# EAGLE design Actor_6_Channel (EAGLE 6.1)
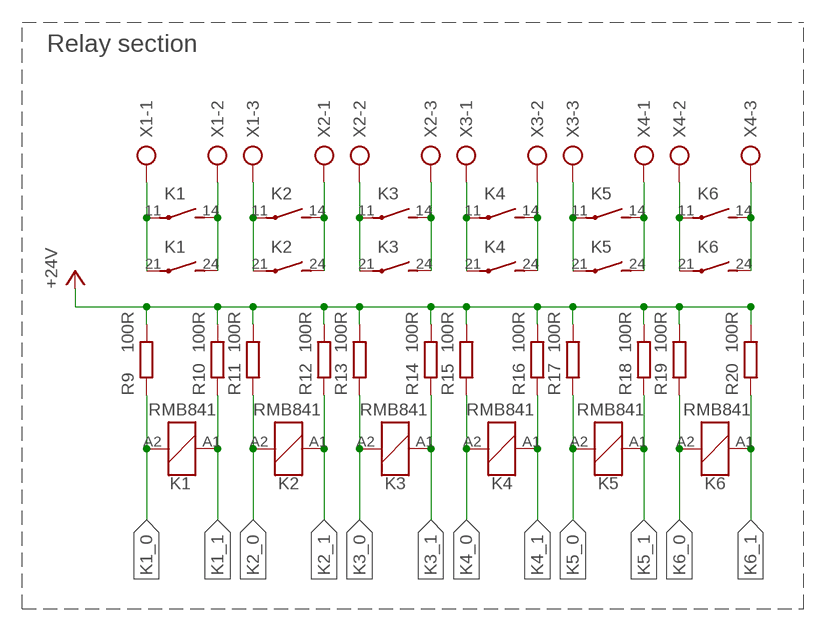
[diagram p0: schematic, sheet 1, part 1 of 2]
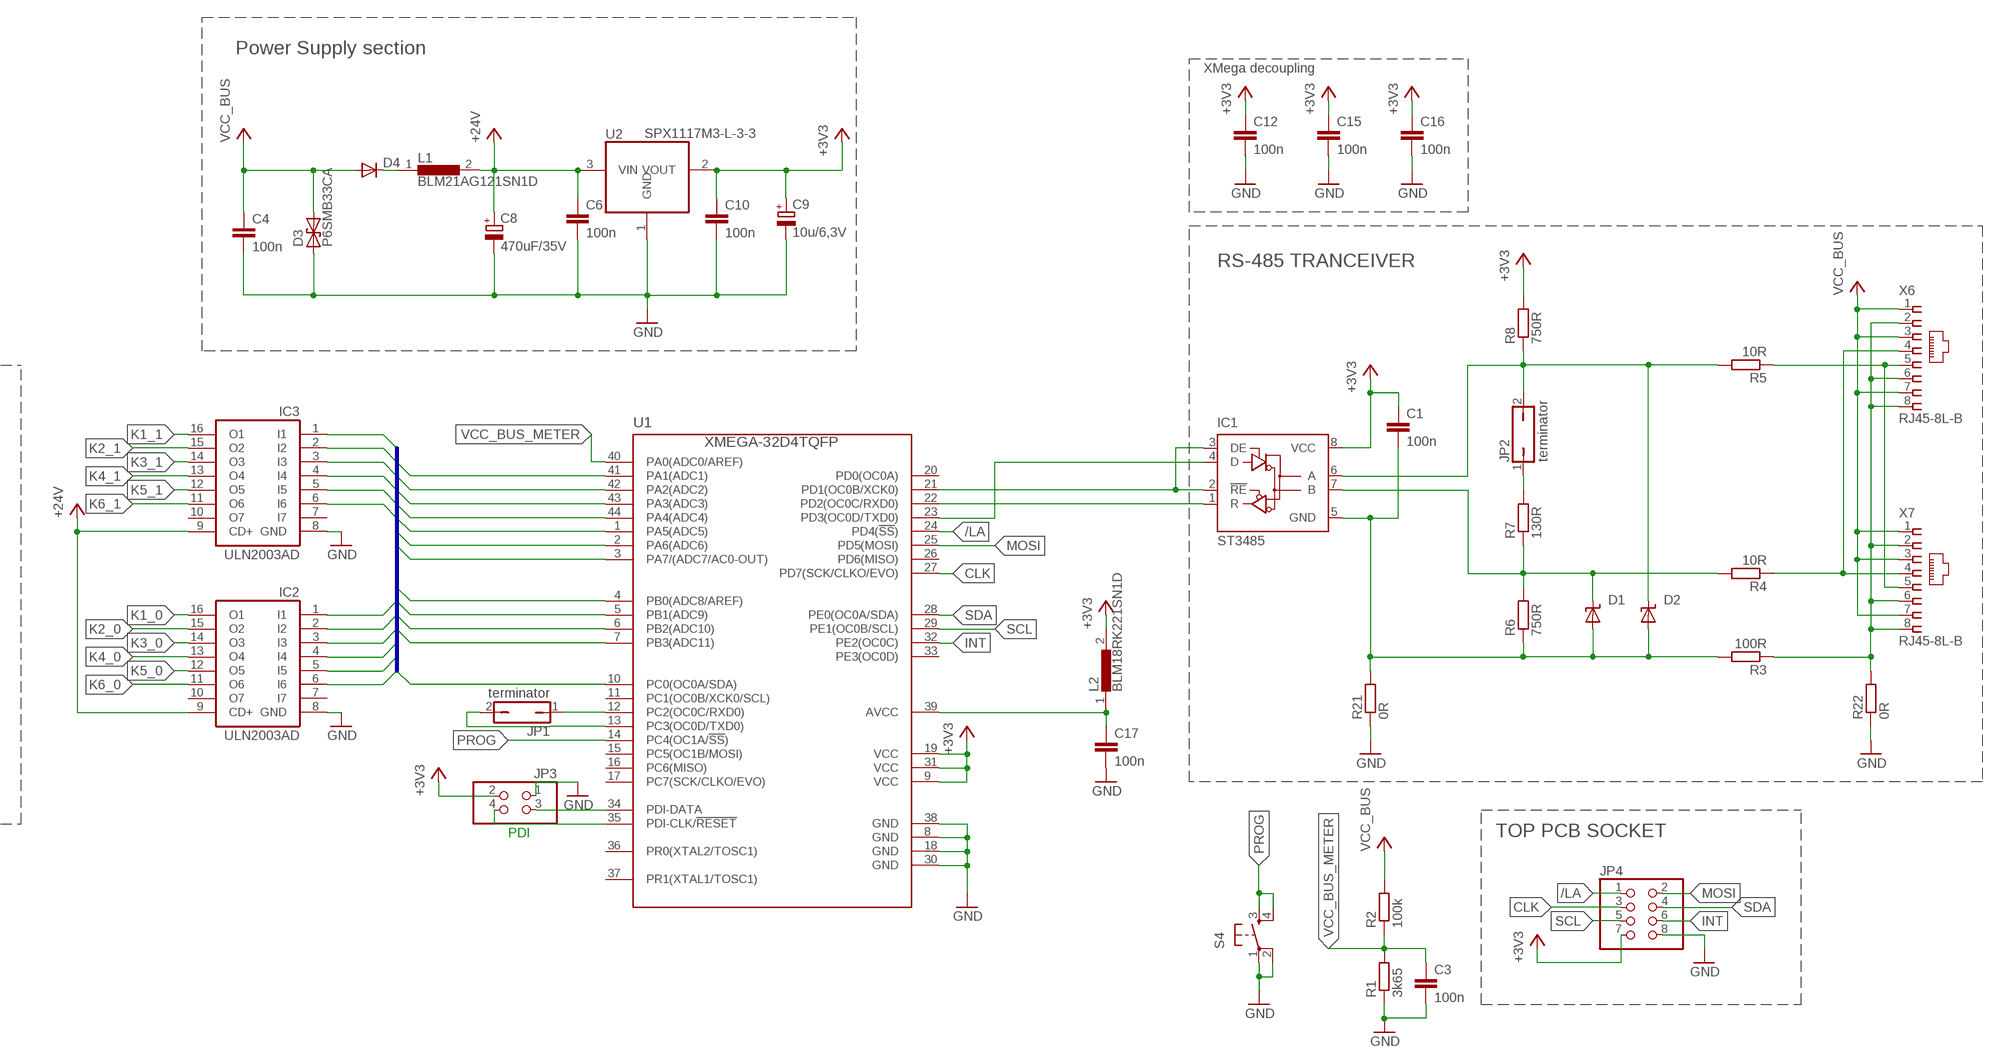
[diagram p1: schematic, sheet 1, part 2 of 2]

## Parts
C1  100n  C-EUC0603K  [C0603K]
C3  100n  C-EUC0603K  [C0603K]
C4  100n  C-EUC0603K  [C0603K]
C6  100n  C-EUC0603K  [C0603K]
C8  470uF/35V  CPOL-EUE5-10.5  [E5-10,5]
C9  10u/6,3V  CPOL-EUE2-4  [E2-4]
C10  100n  C-EUC0603K  [C0603K]
C12  100n  C-EUC0603K  [C0603K]
C15  100n  C-EUC0603K  [C0603K]
C16  100n  C-EUC0603K  [C0603K]
C17  100n  C-EUC0603K  [C0603K]
D1  SUPPRESSOR-SMBJ  [SMBJ]
D2  SUPPRESSOR-SMBJ  [SMBJ]
D3  P6SMB33CA  P6KEXXCSMD  [DO214AA]
D4  DIODE-DO214AA  [DO214AA]
IC1  ST3485  75176AD  [D_R-PDSO-G8]
IC2  ULN2003AD  [SO16]
IC3  ULN2003AD  [SO16]
JP1  terminator  JP1Q  [JP1]
JP2  terminator  JP1Q  [JP1]
JP3  PINHD-2X2  [2X02]
JP4  PINHD-2X4  [2X04]
K1  RMB841  RT444730  [RT2N/O]
K2  RMB841  RT444730  [RT2N/O]
K3  RMB841  RT444730  [RT2N/O]
K4  RMB841  RT444730  [RT2N/O]
K5  RMB841  RT444730  [RT2N/O]
K6  RMB841  RT444730  [RT2N/O]
L1  BLM21AG121SN1D  [805]
L2  BLM18RK221SN1D  [0603]
R1  3k65  R-EU_R0603  [R0603]
R2  100k  R-EU_R0603  [R0603]
R3  100R  R-EU_R0603  [R0603]
R4  10R  R-EU_R0603  [R0603]
R5  10R  R-EU_R0603  [R0603]
R6  750R  R-EU_M1206  [M1206]
R7  130R  R-EU_R0603  [R0603]
R8  750R  R-EU_R0603  [R0603]
R9  100R  R-EU_R0603  [R0603]
R10  100R  R-EU_R0603  [R0603]
R11  100R  R-EU_R0603  [R0603]
R12  100R  R-EU_R0603  [R0603]
R13  100R  R-EU_R0603  [R0603]
R14  100R  R-EU_R0603  [R0603]
R15  100R  R-EU_R0603  [R0603]
R16  100R  R-EU_R0603  [R0603]
R17  100R  R-EU_R0603  [R0603]
R18  100R  R-EU_R0603  [R0603]
R19  100R  R-EU_R0603  [R0603]
R20  100R  R-EU_R0603  [R0603]
R21  0R  R-EU_R0603  [R0603]
R22  0R  R-EU_R0603  [R0603]
S4  SPARKFUN_TAC_SWITCHPTH  [SPARKFUN_TACTILE-PTH]
U1  XMEGA-32D4TQFP  XMEGA-D4TQFP  [TQFP44]
U2  SPX1117M3-L-3-3  REG1117  [SOT223]
X1  MKDS_5/3-7,5  [MKDS_5/-750]
X2  MKDS_5/3-7,5  [MKDS_5/-750]
X3  MKDS_5/3-7,5  [MKDS_5/-750]
X4  MKDS_5/3-7,5  [MKDS_5/-750]
X6  RJ45-8L-B  [RJ45-NO-SHIELD]
X7  RJ45-8L-B  [RJ45-NO-SHIELD]

## Nets
+3V3: C1.1 C9.+ C10.1 C12.1 C15.1 C16.1 IC1.8(VCC) JP3.2 JP4.7 L2.2 R8.2 U1.9(VCC) U1.19(VCC) U1.31(VCC) U2.2(VOUT)
+24V: C6.1 C8.+ IC2.9(CD+) IC3.9(CD+) L1.2 R9.2 R10.2 R11.2 R12.2 R13.2 R14.2 R15.2 R16.2 R17.2 R18.2 R19.2 R20.2 U2.3(VIN)
/LA: JP4.1 U1.24(PD4(!SS!))
A: R5.1 X6.5 X7.5
B: R4.1 X6.4 X7.4
CLK: JP4.3 U1.27(PD7(SCK/CLKO/EVO))
DE_/RE: IC1.2(!RE) IC1.3(DE) U1.21(PD1(OC0B/XCK0))
GND: C3.2 C4.2 C6.2 C8.- C9.- C10.2 C12.2 C15.2 C16.2 C17.2 D3.A IC2.8(GND) IC3.8(GND) JP3.1 JP4.8 R1.1 R21.1 R22.1 S4.1 S4.2 U1.8(GND) U1.18(GND) U1.30(GND) U1.38(GND) U2.1(GND)
INT: JP4.6 U1.32(PE2(OC0C))
K1_0: IC2.16(O1) K1.A2 R9.1
K1_1: IC3.16(O1) K1.A1 R10.1
K2_0: IC2.15(O2) K2.A2 R11.1
K2_1: IC3.15(O2) K2.A1 R12.1
K3_0: IC2.14(O3) K3.A2 R13.1
K3_1: IC3.14(O3) K3.A1 R14.1
K4_0: IC2.13(O4) K4.A2 R15.1
K4_1: IC3.13(O4) K4.A1 R16.1
K5_0: IC2.12(O5) K5.A2 R17.1
K5_1: IC3.12(O5) K5.A1 R18.1
K6_0: IC2.11(O6) K6.A2 R19.1
K6_1: IC3.11(O6) K6.A1 R20.1
MOSI: JP4.2 U1.25(PD5(MOSI))
N$1: K1.11(2:P) K1.21(3:P) X1.1
N$2: K6.11(2:P) K6.21(3:P) X4.2
N$3: K2.14(2:S) K2.24(3:S) X2.1
N$4: K2.11(2:P) K2.21(3:P) X1.3
N$5: K3.11(2:P) K3.21(3:P) X2.2
N$6: K3.14(2:S) K3.24(3:S) X2.3
N$7: K4.11(2:P) K4.21(3:P) X3.1
N$9: K5.11(2:P) K5.21(3:P) X3.3
N$10: K5.14(2:S) K5.24(3:S) X4.1
N$11: JP3.3 U1.34(PDI-DATA)
N$12: K6.14(2:S) K6.24(3:S) X4.3
N$14: JP3.4 U1.35(PDI-CLK/!RESET)
N$15: JP2.1 R7.2
N$16: D1.C IC1.7(B) R4.2 R6.2 R7.1
N$17: D4.C L1.1
N$28: JP1.2 U1.13(PC3(OC0D/TXD0))
N$29: JP1.1 U1.12(PC2(OC0C/RXD0))
N$35: C17.1 L2.1 U1.39(AVCC)
N$36: C1.2 D1.A D2.A IC1.5(GND) R3.2 R6.1 R21.2
N$37: R3.1 R22.2 X6.2 X6.6 X6.8 X7.2 X7.6 X7.8
N$39: K1.14(2:S) K1.24(3:S) X1.2
N$46: K4.14(2:S) K4.24(3:S) X3.2
PA1: IC3.6(I6) U1.41(PA1(ADC1))
PA2: IC3.5(I5) U1.42(PA2(ADC2))
PA3: IC3.4(I4) U1.43(PA3(ADC3))
PA4: IC3.3(I3) U1.44(PA4(ADC4))
PA5: IC3.2(I2) U1.1(PA5(ADC5))
PA6: IC3.1(I1) U1.2(PA6(ADC6))
PA7: IC2.6(I6) U1.3(PA7/(ADC7/AC0-OUT))
PB0: IC2.5(I5) U1.4(PB0(ADC8/AREF))
PB1: IC2.4(I4) U1.5(PB1(ADC9))
PB2: IC2.3(I3) U1.6(PB2(ADC10))
PB3: IC2.2(I2) U1.7(PB3(ADC11))
PC0: IC2.1(I1) U1.10(PC0(OC0A/SDA))
PROG: S4.3 S4.4 U1.14(PC4(OC1A/!SS!))
RS485_A1: D2.C IC1.6(A) JP2.2 R5.2 R8.1
RXD: IC1.1(R) U1.22(PD2(OC0C/RXD0))
SCL: JP4.5 U1.29(PE1(OC0B/SCL))
SDA: JP4.4 U1.28(PE0(OC0A/SDA))
TXD: IC1.4(D) U1.23(PD3(OC0D/TXD0))
VCC_BUS: C4.1 D3.C D4.A R2.2 X6.1 X6.3 X6.7 X7.1 X7.3 X7.7
VCC_BUS_METER: C3.1 R1.2 R2.1 U1.40(PA0(ADC0/AREF))
Unconnected: IC2.7(I7) IC2.10(O7) IC3.7(I7) IC3.10(O7) U1.11(PC1(OC0B/XCK0/SCL)) U1.15(PC5(OC1B/MOSI)) U1.16(PC6(MISO)) U1.17(PC7(SCK/CLKO/EVO)) U1.20(PD0(OC0A)) U1.26(PD6(MISO)) U1.33(PE3(OC0D)) U1.36(PR0(XTAL2/TOSC1)) U1.37(PR1(XTAL1/TOSC1))

## Buses
B1

## Notes on the sheet
- Power Supply section
- XMega decoupling
- RS-485 TRANCEIVER
- Relay section
- PDI | TOP PCB SOCKET

## Library data of the parts
C1 C3 C4 C6 C10 C12 C15-C17 = rcl:C-EU: CAPACITOR, European symbol
C8 C9 = rcl:CPOL-EU: POLARIZED CAPACITOR, European symbol
D1 D2 = diode:SUPPRESSOR-: Suppressor diode
D3 = diode:P6KEXXC: DIODE transient-voltage suppressor
D4 = diode:DIODE-: DIODE
IC1 = 751xx:75176A: DIFFERENTIAL BUS TRANSCEIVER Source: http://focus.ti.com/lit/ds/symlink/sn75176a.pdf
IC2 IC3 = uln-udn:ULN2003A: DRIVER ARRAY
JP1 JP2 = jumper:JP1Q: JUMPER
JP3 = pinhead:PINHD-2X2: PIN HEADER
JP4 = pinhead:PINHD-2X4: PIN HEADER
K1-K6 = relay:RT44?*: Power PCB Relay SCHRACK 2 pole 8 A, DC and AC-coil Source: http://www.schrack.com/.. 5842.pdf; OC_FARNELL: unknown; OC_NEWARK: unknown
L1 = inductors:BLM21AG121SN1D
L2 = inductors:BLM18RK221SN1D
R1-R22 = rcl:R-EU_: RESISTOR, European symbol
S4 = Nokia-Breakout-v14:SPARKFUN_TAC_SWITCH: Momentary Switch Button commonly used for reset or general input. Spark Fun Electronics SKU : COM-00097
U1 = avr-7:XMEGA-D4: Atmel AVR XMega D4 series processor
U2 = burr-brown:REG1117: 800mA and 1A Low Dropout (LDO) Positive Regulator 1.8V, 2.5V, 2.85V, 3.3V, 5V, and Adj; MPN: REG1117; OC_FARNELL: 1097566; OC_NEWARK: 14P6981
X1-X4 = con-phoenix-mkds_5:MKDS_5/3-: MKDS 5/3-6,35 Source: PHOENIX CONTACT
X6 X7 = con-tycoelectronics:RJ45: CORCOM Modular RJ Jacks No Shield Source: www.tycoelectronics.com .. ENG_DS_1654001_1099_RJ_L_0507.pdf; MF: TYCO ELECTRONICS; MPN: RJ45-8L-B; OC_FARNELL: 1279843; OC_NEWARK: 52K4445

## Board
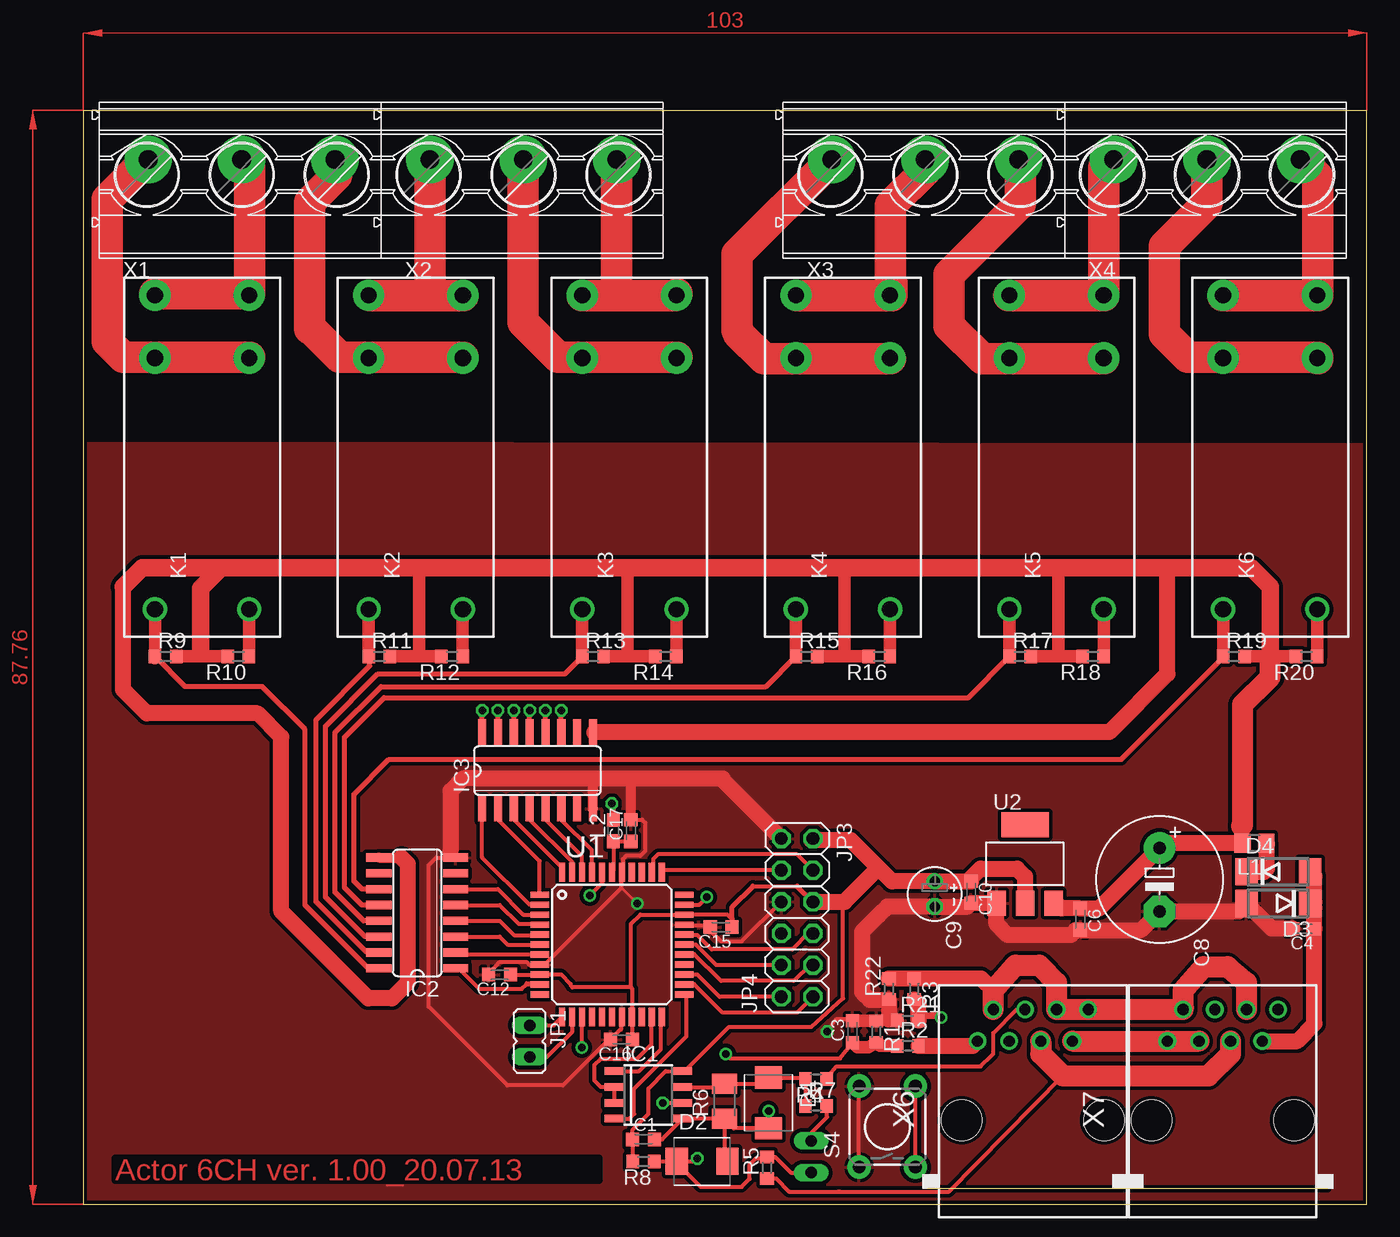
[diagram p2: board, top side]
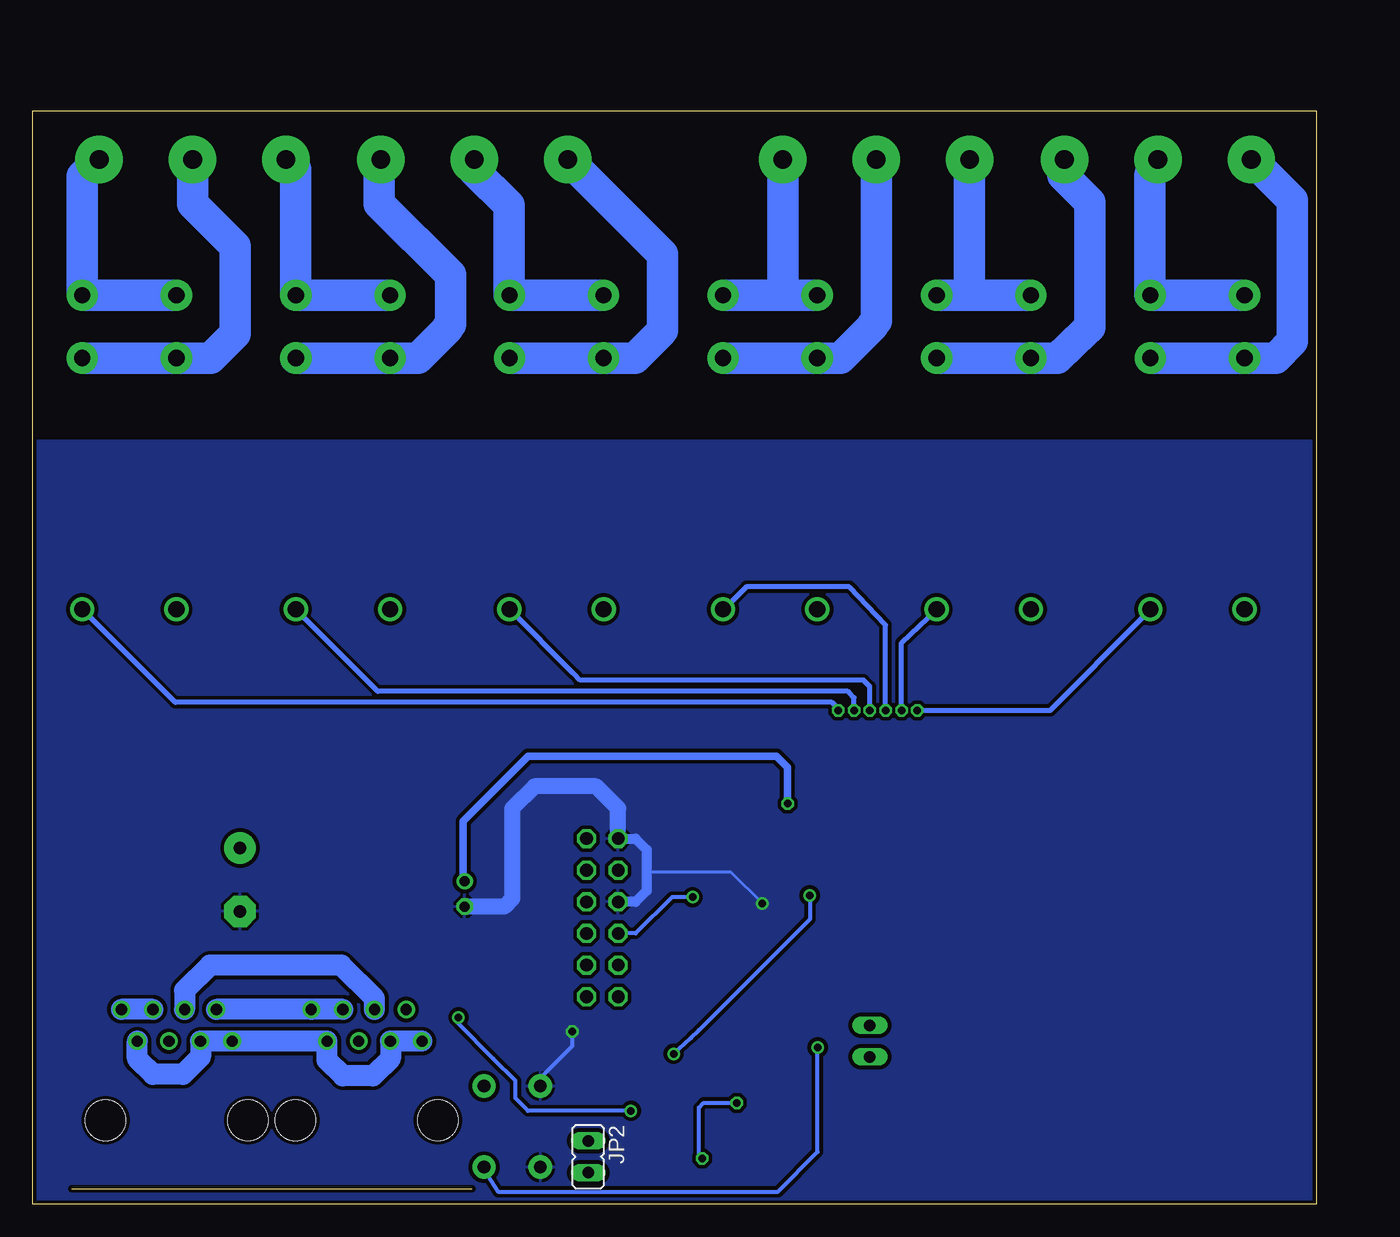
[diagram p3: board, bottom side, seen from below]

Size 103 x 87.73 mm. Coordinates in mm from the lower left corner, seen from the top.
Outline: 0,0 103,0 103,87.73 0,87.73 0,0
Copper layers (1*16): Top 0.035mm / dielectric 1.5mm / Bottom 0.035mm
Design rules: minimum track width 10mil, minimum drill 24mil, track to track 10mil, track to pad 10mil, pad to pad 10mil, via to via 10mil, smd to smd 8mil, copper to edge 10mil, drill to drill 8mil, minimum pad ring 10mil, minimum via ring 8mil, stop-mask expansion 4mil, vias tented up to drill 0mil, thermal gap 10mil

### Footprints (pad centres in the part's own frame; a part is rotated, then mirrored left to right if it is on the bottom)
C0603K = smd 1.05 x 1.08: 1 -0.875,0; 2 0.875,0
E5-10,5 = drill 1.016 pad 2.54: + -2.54,0 | drill 1.016 pad 2.54 octagon: - 2.54,0
E2-4 = drill 0.813 pad 1.27: + -1.016,0 | drill 0.813 pad 1.27 octagon: - 1.016,0
SMBJ = smd 1.78 x 2.16: A 2.04,0; C -2.03,0
DO214AA = smd 1.8 x 2.2: A 2.55,0; C -2.55,0
D_R-PDSO-G8 = smd 0.6 x 1.5: 1 -1.905,-2.75; 2 -0.635,-2.75; 3 0.635,-2.75; 4 1.905,-2.75; 5 1.905,2.75; 6 0.635,2.75; 7 -0.635,2.75; 8 -1.905,2.75
SO16 = smd 0.66 x 2.032: 1 -4.445,-3.073; 2 -3.175,-3.073; 3 -1.905,-3.073; 4 -0.635,-3.073; 5 0.635,-3.073; 6 1.905,-3.073; 7 3.175,-3.073; 8 4.445,-3.073; 9 4.445,3.073; 10 3.175,3.073; 11 1.905,3.073; 12 0.635,3.073; 13 -0.635,3.073; 14 -1.905,3.073; 15 -3.175,3.073; 16 -4.445,3.073
JP1 = drill 0.914 long: 1 0,-1.27; 2 0,1.27
2X02 = drill 1.016 octagon: 1 -1.27,-1.27; 2 -1.27,1.27; 3 1.27,-1.27; 4 1.27,1.27
2X04 = drill 1.016 octagon: 1 -3.81,-1.27; 2 -3.81,1.27; 3 -1.27,-1.27; 4 -1.27,1.27; 5 1.27,-1.27; 6 1.27,1.27; 7 3.81,-1.27; 8 3.81,1.27
RT2N/O = drill 1.3 pad 2.5: 11 7.56,-3.78; 14 12.6,-3.78; 21 7.56,3.78; 24 12.6,3.78 | drill 1.3: A1 -12.6,-3.78; A2 -12.6,3.78
805 = smd 1.3 x 1.5: 1 -0.95,0; 2 0.95,0
0603 = smd 1.1 x 1: 1 -0.85,0; 2 0.85,0
R0603 = smd 1 x 1.1: 1 -0.85,0; 2 0.85,0
M1206 = smd 1.6 x 2: 1 -1.4,0; 2 1.4,0
SPARKFUN_TACTILE-PTH = drill 1.016 pad 1.88: 1 -3.251,2.261; 2 3.251,2.261; 3 -3.251,-2.261; 4 3.251,-2.261
TQFP44 = smd 1.5 x 0.5: 1 -5.8,4; 2 -5.8,3.2; 3 -5.8,2.4; 4 -5.8,1.6; 5 -5.8,0.8; 6 -5.8,0; 7 -5.8,-0.8; 8 -5.8,-1.6; 9 -5.8,-2.4; 10 -5.8,-3.2; 11 -5.8,-4; 23 5.8,-4; 24 5.8,-3.2; 25 5.8,-2.4; 26 5.8,-1.6; 27 5.8,-0.8; 28 5.8,0; 29 5.8,0.8; 30 5.8,1.6; 31 5.8,2.4; 32 5.8,3.2; 33 5.8,4 | smd 0.5 x 1.5: 12 -4,-5.8; 13 -3.2,-5.8; 14 -2.4,-5.8; 15 -1.6,-5.8; 16 -0.8,-5.8; 17 0,-5.8; 18 0.8,-5.8; 19 1.6,-5.8; 20 2.4,-5.8; 21 3.2,-5.8; 22 4,-5.8; 34 4,5.8; 35 3.2,5.8; 36 2.4,5.8; 37 1.6,5.8; 38 0.8,5.8; 39 0,5.8; 40 -0.8,5.8; 41 -1.6,5.8; 42 -2.4,5.8; 43 -3.2,5.8; 44 -4,5.8
SOT223 = smd 1.499 x 2.007: 1 -2.261,-3.15; 2 0.025,-3.15; 3 2.311,-3.15 | smd 3.81 x 2.007: 4 0,3.15
MKDS_5/-750 = drill 1.5 pad 3.81: 1 -7.5,0; 2 0,0; 3 7.5,0
RJ45-NO-SHIELD = drill 0.9 pad 1.4: 1 -4.445,6.35; 2 -3.175,8.89; 3 -1.905,6.35; 4 -0.635,8.89; 5 0.635,6.35; 6 1.905,8.89; 7 3.175,6.35; 8 4.445,8.89 | hole 3.251: -5.715,0; 5.715,0

### Placement (x,y rotation side)
C1  44.96,5.21 0 top
C3  61.72,13.84 90 top
C4  97.92,22.1 180 top
C6  80.01,22.86 270 top
C8  86.36,26.04 270 top
C9  68.33,24.89 270 top
C10  71.25,25.02 270 top
C12  33.4,18.41 180 top
C15  51.18,22.23 180 top
C16  43.18,13.21 180 top
C17  43.94,29.97 90 top
D1  54.99,8.13 270 top
D2  49.66,3.43 0 top
D3  95.89,24.13 180 top
D4  95.89,26.67 0 top
IC1  45.34,8.76 270 top
IC2  26.8,23.37 90 top
IC3  36.45,34.8 0 top
JP1  35.81,13.08 180 top
JP2  58.42,3.81 180 bottom
JP3  57.28,28.07 270 top
JP4  57.28,20.45 90 top
K1  9.53,60.33 90 top
K2  26.67,60.33 90 top
K3  43.81,60.33 90 top
K4  60.96,60.33 90 top
K5  78.11,60.33 90 top
K6  95.25,60.33 90 top
L1  93.98,28.96 180 top
L2  42.55,29.97 90 top
R1  63.63,13.84 270 top
R2  66.17,12.7 0 top
R3  66.67,17.27 270 top
R4  58.8,10.03 180 top
R5  54.86,2.92 90 top
R6  51.44,8.26 90 top
R7  58.8,7.87 0 top
R8  44.96,3.43 180 top
R9  6.6,43.94 0 top
R10  12.45,43.94 180 top
R11  23.75,43.94 0 top
R12  29.59,43.94 180 top
R13  40.89,43.94 0 top
R14  46.74,43.94 180 top
R15  58.04,43.94 0 top
R16  63.88,43.94 180 top
R17  75.18,43.94 0 top
R18  81.03,43.94 180 top
R19  92.33,43.94 0 top
R20  98.17,43.94 180 top
R21  66.17,14.73 0 top
R22  64.64,17.27 90 top
S4  64.52,6.22 90 top
U1  42.42,20.83 0 top
U2  75.56,27.3 0 top
X1  12.7,83.82 0 top
X2  35.31,83.82 0 top
X3  67.56,83.82 0 top
X4  90.17,83.82 0 top
X6  76.2,6.73 0 top
X7  91.44,6.73 0 top

### Tracks (layer width: path | path; a pad name or v marks a point on that pad's centre or on a via)
+3V3  (via drill 0.6)
  Top 0.254: 44.45,3.81 R8.2 | 44.45,5.08 C1.1 | 58.42,29.21 JP3.2
  Top 0.305: 44.08,3.32 44.07,3.3 44.08,3.32 | C16.1 44.05,14.97 44.07,14.99 44.07,15.11 44.07,15.24 | 46.74,10.67 45.34,9.27 45.34,7.24 44.08,5.98 C1.1 44.08,4.7 44.08,3.32 | 46.74,10.67 IC1.8 | C12.1 36.6,18.41 U1.9 38.34,18.43 39.12,17.65 39.12,17.53 39.24,17.4 43.94,17.4 | 44.07,15.24 44.07,17.27 43.94,17.4 | 43.94,17.4 43.94,22.48 44.7,23.24 48.13,23.24 | 48.13,23.24 48.2,23.24 U1.31 | C15.1 52.06,22.87 51.69,23.24 48.26,23.24 | 48.26,23.24 48.13,23.24 | 48.13,23.24 48.26,23.24 | 53.72,25.53 57.28,25.53 | 46.74,10.67 48.26,10.67 51.82,14.22 58.42,14.22 60.96,16.51 60.96,24.26 61.09,24.38 | U1.19 44.02,15.19 44.07,15.24 | 44.08,3.32 44.08,3.4 R8.2
  Top 0.406: 52.06,22.87 52.06,23.86 53.72,25.53 | 57.28,25.53 JP4.7 | L2.2 42.55,31.88 v42.42,32.13 | 61.09,24.26 60.96,24.26
  Top 1.27: U2.2 75.56,24.18 75.56,26.29 74.93,26.92 72.01,26.92 71.25,26.16 C10.1 71.23,25.91 C9.+ 64.9,25.91 | 64.9,25.91 64.01,26.8 | 64.01,26.8 61.59,29.21 58.42,29.21 | JP4.7 60.96,24.26 61.09,24.26 63.5,26.67 63.63,26.8 64.01,26.8 | 64.9,25.91 64.01,26.8
  Bottom 0.61: v42.42,32.13 42.42,35.05 43.31,35.94 63.25,35.94 68.45,30.73 68.45,26.04 C9.+
+24V
  Top 0.254: U2.3 77.47,24.13 77.98,24.26
  Top 0.305: 41.02,37.85 40.77,37.85 | 40.77,37.85 40.64,37.97 40.77,37.85 | 40.77,37.85 40.64,37.85 IC3.9
  Top 0.813: IC2.9 25.53,27.81
  Top 1.016: R19.2 95.25,43.94 95.76,43.94 | 95.76,43.94 R20.2 | R17.2 R18.2 78.23,43.94 78.23,51.05 | R16.2 R15.2 61.09,43.94 61.09,51.05 | R14.2 R13.2 43.69,43.94 43.69,51.05 | R12.2 R11.2 26.92,43.94 26.92,51.05 | R9.2 R10.2 9.4,43.94 9.4,44.45 | 95.25,44.58 95.25,44.45 95.76,43.94 | 92.96,30.35 92.96,29.02 L1.2
  Top 1.27: L1.2 86.74,28.96 C8.+ 81.52,23.73 C6.1 78.5,23.73 77.98,24.26 U2.3 77.85,24.13 | 25.53,27.81 26.04,27.3 26.04,17.78 24.77,16.51 22.86,16.51 15.88,23.5 15.88,37.47 13.97,39.37 5.08,39.37 3.17,41.27 3.17,49.53 | 87,51.05 87,42.55 82.32,37.87 41.05,37.87 41.02,37.85
  Top 1.422: 9.4,44.45 9.4,49.4 11.05,51.05 12.06,51.05 | 12.06,51.05 26.92,51.05 43.69,51.05 61.09,51.05 78.23,51.05 87,51.05 93.73,51.05 95.25,49.53 95.25,44.83 95.25,44.58 | 3.17,49.53 4.7,51.05 12.06,51.05
  Top 1.676: 95.25,43.94 95.25,42.29 95.12,42.16 93.03,40.07 93.03,30.42 92.96,30.35
/LA
  Top 0.305: JP4.1 57.28,15.37 51.31,15.37 49.02,17.65 48.24,17.65 U1.24
A
  Top 0.305: R5.1 55.59,2.07 56.64,1.02 60.58,1.02 60.71,1.02 69.47,1.02 78.61,10.29
  Top 1.676: X6.5 76.83,12.06 78.61,10.29 90.3,10.29 92.08,12.06 X7.5
B
  Top 0.305: R4.1 59.65,10.12 60.45,11.05 72.01,11.05 72.9,11.94 73.03,12.06 73.03,13.72 74.93,15.62 X6.4
  Bottom 1.676: X6.4 75.56,16.51 78.23,19.18 88.77,19.18 90.81,17.14 X7.4
CLK
  Top 0.305: JP4.3 58.29,19.18 57.02,17.91 51.18,17.91 49.02,20.07 48.26,20.07 U1.27
DE_/RE
  Top 0.305: IC1.3 IC1.2 41.53,9.4 41.02,9.91 41.02,11.18 41.53,11.68 44.45,11.68 45.59,12.83 45.59,15 U1.21
GND  (via drill 0.6, 0.61)
  Top 0.254: v44.45,24.13 43.18,25.4 | 43.18,15.24 U1.18 | 43.18,15.24 U1.18 | 43.18,15.24 43.18,13.97 43.12,14.03 | 43.18,15.24 U1.18
  Top 0.305: U1.30 48.29,22.35 49.15,22.35 50.29,22.35 C15.2 50.31,21.96 51.18,21.08 52.83,21.08 JP4.8 | S4.1 S4.2 | 61.59,14.73 61.72,14.61 C3.2 | C3.2 61.72,14.73 | C12.2 32.53,18.56 33.27,19.3 33.4,19.43 35.56,19.43 35.81,19.18 36.57,19.18 U1.8 37.01,19.23 43.18,25.4 43.18,26.59 U1.38 | v59.69,13.84 60.45,14.86 61.58,14.86 C3.2 | C17.2 44.84,30.85 45.09,30.61 45.09,29.08 45.09,28.83 45.09,28.32 44.7,27.94 43.56,27.94 43.31,27.69 43.31,26.54 | 29.46,28.32 29.87,27.91 IC2.8 28.32,27.81 27.69,27.18 27.69,15.88 34.04,9.53 38.48,9.53 42.29,13.34 42.29,13.22 C16.2 42.3,13.22 43.12,14.03 43.18,14.1 43.18,14.99
  Top 0.813: IC3.8 40.89,34.16 42.8,34.16 | C17.2 43.94,34.04 43.81,34.16 | 51.31,34.16 51.31,34.04
  Top 1.016: C3.2 63.6,14.72 R1.1 64.64,14.82 65.28,14.69 R21.1
  Top 1.27: C4.2 95.37,22.1 D3.A 92.7,23.5 C8.- 84.85,21.98 C6.2 79.64,21.98 79.25,21.59 74.17,21.59 73.28,22.48 73.28,24 73.28,24.13 U2.1 71.26,24.16 C10.2 70.98,23.88 C9.- 64.52,23.88 63.82,23.18 62.48,21.84 62.48,17.02 63.12,16.38 64.6,16.38 R22.1 64.64,14.82 | 51.31,34.16 43.81,34.16 42.8,34.16 40.89,34.16 31.62,34.16 30.48,34.16 29.46,33.15 29.46,28.32 | 51.31,34.04 JP3.1
  Bottom 0.254: v44.45,24.13 46.99,26.67 53.34,26.67 53.72,26.67
  Bottom 0.305: S4.2 62.26,10.13 59.69,12.7 v59.69,13.84
  Bottom 0.813: JP3.1 54.61,29.34 53.72,28.45 53.72,26.67 53.72,25.15 54.61,24.26 JP4.8
  Bottom 1.27: JP3.1 56.01,31.75 57.78,33.53 62.74,33.53 64.52,31.75 64.52,24.51 65.15,23.88 C9.-
  pour Top (isolate 0.305): 0.25,61.09 102.87,60.96 102.87,0.13 0.13,0.13
  pour Bottom (isolate 0.305): 0.13,61.21 102.87,61.21 102.87,0.25 0.13,0.25
INT  (via drill 0.6)
  Top 0.305: U1.32 49.43,24.03 v50.04,24.64
  Bottom 0.254: JP4.6 55.88,21.59 55.88,21.72
  Bottom 0.305: v50.04,24.64 51.69,24.64 54.61,21.72 55.88,21.72 JP4.6 56.13,21.72
K1_0
  Top 0.406: IC2.16 22.86,18.92 17.78,24 17.78,38.1 14.35,41.53 8.17,41.53 R9.1
  Top 1.016: K1.A2 5.75,43.84 | 5.75,43.84 5.71,43.81 | 5.75,43.84 R9.1
K1_1  (via drill 0.6)
  Top 0.406: IC3.16 v32,39.62
  Top 1.016: K1.A1 13.3,43.95 R10.1
  Bottom 0.254: 13.97,46.99 13.97,48.26 K1.A1
  Bottom 0.305: 13.21,47.75 13.34,47.75
  Bottom 0.406: v32,39.62 21.66,39.62 21.34,39.62 13.97,46.99 13.21,47.75
K2_0
  Top 0.305: IC2.15 22.73,20.19 | 22.99,43.85 R11.1
  Top 0.406: 22.73,20.19 18.8,24.13 18.67,24.26 18.67,38.86 22.99,43.18 22.99,43.85
  Top 1.016: K2.A2 22.89,43.95 R11.1
K2_1  (via drill 0.6)
  Top 0.406: IC3.15 v33.27,39.62
  Top 1.016: K2.A1 30.45,43.95 R12.1
  Bottom 0.406: v33.27,39.62 33.27,45.03 K2.A1
K3_0
  Top 0.406: IC2.14 22.61,21.46 19.56,24.51 19.43,24.64 19.43,37.97 19.43,38.35 23.62,42.55 38.65,42.55 R13.1
  Top 1.016: K3.A2 40.03,43.95 R13.1
K3_1  (via drill 0.6)
  Top 0.406: IC3.14 v34.54,39.62
  Top 1.016: K3.A1 47.59,43.95 R14.1
  Bottom 0.254: 47.62,47.62 47.62,47.7 K3.A1
  Bottom 0.406: v34.54,39.62 34.54,46.48 37.47,49.53 45.72,49.53 47.62,47.62
K4_0
  Top 0.406: IC2.13 22.48,22.73 20.19,25.02 20.19,37.85 23.88,41.53 54.78,41.53 R15.1
  Top 1.016: K4.A2 57.18,43.95 R15.1
K4_1  (via drill 0.6)
  Top 0.406: IC3.13 v35.81,39.62
  Top 1.016: K4.A1 64.74,43.95 R16.1
  Bottom 0.406: 59.56,42.55 59.62,42.61 | 59.62,42.61 K4.A1 | v35.81,39.62 35.81,41.53 36.32,42.04 59.05,42.04 59.56,42.55 59.62,42.61
K5_0
  Top 0.406: IC2.12 22.35,24 20.95,25.4 20.95,37.47 24.13,40.64 71.03,40.64 R17.1
  Top 1.016: K5.A2 74.33,43.95 R17.1
K5_1  (via drill 0.6)
  Top 0.406: IC3.12 v37.08,39.62
  Top 1.016: K5.A1 81.89,43.95 R18.1
  Bottom 0.406: v37.08,39.62 37.08,40.64 37.47,41.02 37.59,41.15 75.31,41.15 K5.A1
K6_0
  Top 0.254: 91.44,44.45 R19.1
  Top 0.305: 27.56,35.69 27.69,35.69 | 91.57,43.94 91.44,43.94 91.45,43.95 91.47,43.95
  Top 0.406: 91.57,43.94 83.31,35.69 27.69,35.69 24.51,35.69 21.72,32.89 21.72,25.91 21.84,25.78 22.35,25.27 IC2.11
  Top 1.016: K6.A2 91.47,43.95 R19.1
K6_1  (via drill 0.6)
  Top 0.406: IC3.11 v38.35,39.62
  Top 1.016: K6.A1 99.03,43.95 R20.1
  Bottom 0.406: v38.35,39.62 38.35,39.75 38.86,40.26 91.56,40.26 K6.A1
MOSI
  Top 0.305: JP4.2 51.05,16.64 49.28,18.41 48.23,18.41 U1.25
N$1
  Bottom 2.54: K1.11 K1.21 3.23,67.89 1.91,69.22 1.91,80.53 X1.1
N$2
  Top 2.54: 99.06,67.82 99.06,67.94 88.65,67.94 86.74,69.85 86.74,76.83 90.17,80.26 X4.2
  Bottom 2.54: K6.21 K6.11 88.71,67.89 86.74,69.85 86.74,76.83 90.17,80.26 X4.2
N$3
  Bottom 2.54: K2.24 27.56,72.92 | 27.56,72.92 K2.14 | X2.1 27.81,73.17 27.56,72.92
N$4
  Bottom 2.54: K2.11 K2.21 20.76,67.89 18.54,69.98 18.16,70.36 18.16,79.5 18.16,80.39 20.32,82.55 20.32,83.7 X1.3
N$5
  Top 2.54: X2.2 35.31,70.74 38.1,67.94 47.62,67.94
  Bottom 2.54: K3.11 K3.21 38.16,67.89 35.56,70.48 35.56,70.61 35.31,70.87 X2.2
N$6
  Bottom 2.54: K3.14 43.18,72.92 | 43.18,72.92 K3.24 | X2.3 42.81,73.3 43.18,72.92
N$7
  Bottom 2.54: K4.11 K4.21 54.67,67.89 52.7,69.85 52.45,70.1 52.45,76.21 X3.1
N$8
  Top 2.54: 91.44,72.9 99.06,72.9 99.06,82.42 97.54,83.95
N$9
  Bottom 2.54: K5.11 K5.21 72.07,67.89 69.72,70.23 69.72,70.36 69.47,70.61 69.47,74.55 75.18,80.26 75.18,83.7 X3.3
N$10
  Bottom 2.54: K5.24 K5.14 81.89,83.03 X4.1
N$11
  Top 0.305: JP3.3 46.59,26.8 U1.34
N$12
  Bottom 2.54: K6.24 K6.14 99.03,82.46 X4.3
N$14
  Top 0.254: 45.72,26.67 U1.35
  Top 0.305: JP3.4 57.28,28.07 46.1,28.07 45.72,27.69 45.72,26.67 | 45.72,26.67 45.72,26.54 45.59,26.42 45.59,26.54 45.72,26.67
N$15
  Top 0.305: JP2.1 58.42,5.71 59.69,6.99 59.69,7.83 R7.2
N$16
  Top 0.305: IC1.7 51.18,9.4 R6.2 54.49,9.65 D1.C 57.83,10.16 R4.2 R7.1
N$17
  Top 1.27: D4.C 94.74,26.67 95,26.92 95,28.89 L1.1
N$28
  Top 0.305: JP1.2 37.21,11.81 39.24,13.84 39.24,15 U1.13
N$29
  Top 0.305: JP1.1 37.74,14.35 U1.12
N$35
  Top 0.305: U1.39 42.55,26.75 L2.1 42.55,29.21 42.66,29.1 C17.1
N$36  (via drill 0.6)
  Top 0.254: R21.2 67.31,15.24 68.58,15.24 v68.83,14.99
  Top 0.305: R6.1 IC1.5 46.44,5.21 C1.2 | R6.1 52.2,6.09 D1.A v54.99,7.49 | R6.1 51.44,3.69 D2.A | v68.83,14.99 67.31,14.99 67.06,14.73
  Top 1.27: R21.2 67.02,16.08 R3.2
  Bottom 0.305: v54.99,7.49 63.25,7.49 64.26,8.51 64.26,9.91 66.04,11.68 68.83,14.48 v68.83,14.99
N$37
  Top 1.27: R22.2 R3.1 72.05,18.12 73.03,17.14
  Top 1.676: X6.2 73.03,17.14 74.8,19.18 76.71,19.18 78.11,17.78 78.11,15.88 X6.6 X7.2 88.27,15.88 88.27,17.14 89.92,19.05 91.82,19.05 93.34,17.78 X7.6
  Bottom 1.676: X6.6 X6.8 X7.2 | X7.6 X7.8
N$38
  Top 2.54: 13.34,67.94 3.17,67.94 1.91,69.22 1.91,80.64 5.08,83.82
N$39
  Top 2.54: 5.71,73.03 13.34,73.03 13.34,83.19 X1.2
  Bottom 2.54: K1.24 K1.14 13.34,72.95 13.34,82.55 12.7,83.19 X1.2
N$40
  Top 2.54: 30.48,67.94 20.57,67.94 18.29,70.23 18.16,70.23 18.16,80.39 20.32,82.55 20.32,83.82
N$41
  Top 2.54: 22.99,72.9 30.48,72.9
N$42
  Top 2.54: 27.94,83.82 27.94,83.57 27.81,83.44 27.81,73.15
N$43
  Top 2.54: 40.01,72.9 47.5,72.9 47.62,73.03
N$44
  Top 2.54: 42.8,83.82 42.8,73.79
N$45
  Top 2.54: 64.77,67.82 54.61,67.82 52.58,69.85 52.58,69.98 52.45,70.1 52.45,76.2 59.94,83.69
N$46
  Top 2.54: 57.28,72.9 64.9,72.9 64.9,73.91 64.77,74.04 64.77,80.14 67.56,82.93 X3.2
  Bottom 2.54: K4.24 K4.14 64.77,72.95 64.77,80.14 67.56,82.93 X3.2
N$47
  Top 2.54: 81.92,67.82 72.14,67.82 69.47,70.48 69.47,74.55 75.06,80.14 75.18,80.26 75.18,83.82
N$48
  Top 2.54: 74.3,72.9 81.92,72.9 81.92,83.19 82.68,83.95
PA1
  Top 0.305: U1.41 40.82,28.4 38.35,30.86 IC3.6
PA2
  Top 0.305: U1.42 40.02,27.93 37.08,30.86 IC3.5
PA3
  Top 0.305: U1.43 39.22,27.46 35.81,30.86 IC3.4
PA4
  Top 0.305: U1.44 38.42,26.99 34.54,30.86 IC3.3
PA5
  Top 0.305: U1.1 36.62,27.52 33.27,30.86 IC3.2 | IC3.2 33.27,31.75 | 33.27,31.75 33.27,31.88 33.27,31.75 | IC3.2 33.27,31.75
PA6
  Top 0.305: U1.2 35.79,24.03 32,27.81 IC3.1
PA7
  Top 0.305: IC2.6 33.27,25.27 35.31,23.24 36.6,23.24 U1.3
PB0
  Top 0.305: IC2.5 33.4,24 34.92,22.48 36.57,22.48 U1.4
PB1
  Top 0.305: IC2.4 33.4,22.73 34.54,21.59 36.58,21.59 U1.5
PB2
  Top 0.305: IC2.3 33.4,21.46 34.04,20.83 U1.6
PB3
  Top 0.305: IC2.2 29.84,20.19 29.97,20.07 36.58,20.07 U1.7
PC0
  Top 0.254: U1.10 36.83,17.78 35.56,17.78 35.56,17.65
  Top 0.305: IC2.1 30.1,18.92 31.75,17.27 35.18,17.27 35.56,17.65 36.58,17.65
PROG  (via drill 0.6)
  Top 0.305: S4.4 S4.3 66.78,3.02 66.8,3.05 | v40.01,12.57 40.01,15.02 U1.14
  Bottom 0.305: v40.01,12.57 40.01,4.19 43.18,1.02 65.66,1.02 66.78,2.77 S4.3
RS485_A1  (via drill 0.6)
  Top 0.305: R8.1 D2.C | D2.C 47.63,3.3 49.53,1.4 52.83,1.4 53.47,2.03 53.47,3.17 53.98,3.68 54.78,3.68 R5.2 55.54,3.77 56.77,2.54 JP2.2 57.91,2.54 | D2.C 49.02,3.43 v49.28,3.68 | v46.48,8.13 IC1.6
  Bottom 0.305: v49.28,3.68 49.53,3.94 49.53,7.62 49.53,7.75 49.15,8.13 v46.48,8.13
RXD
  Top 0.305: IC1.1 44.58,10.67 46.35,12.45 46.35,14.96 U1.22
SCL
  Top 0.254: 48.26,21.59 U1.29
  Top 0.305: JP4.5 58.17,21.72 56.9,20.45 50.42,20.45 49.28,21.59 48.26,21.59
SDA
  Top 0.305: JP4.4 50.8,19.18 49.15,20.83 U1.28
TXD
  Top 0.305: IC1.4 43.81,6.86 44.2,7.24 44.2,9.27 48.39,13.46 48.39,16.66 U1.23
VCC_BUS
  Top 1.27: X7.7 97.41,13.08 98.81,14.48 98.81,22.08 C4.1 98.79,23.77 D3.C 98.68,24.13 98.81,24.26 98.81,26.3 D4.A | R2.2 71.37,12.7 X6.1
  Top 1.676: X6.7 X7.1 X7.3
  Bottom 1.676: X7.7 94.61,11.68 94.49,11.56 93.34,10.41 90.93,10.41 89.53,11.81 X7.3 X7.1 X6.7 79.38,11.56 78.11,10.29 75.69,10.29 74.3,11.68 X6.3 X6.1
VCC_BUS_METER  (via drill 0.6)
  Top 0.305: U1.40 41.62,25.74 v40.64,24.77 | v51.56,12.06 51.93,11.7 60.72,11.7 61.72,12.95 C3.1
  Top 0.813: R1.2 63.28,12.74
  Top 1.016: R2.1 63.92,12.7 R1.2 | 63.28,12.74 62.99,12.57 62.12,12.57 C3.1
  Bottom 0.305: v40.64,24.77 40.64,22.86 49.53,13.97 50.16,13.34 v51.56,12.06
(copper drawn outside any net)
  shapes: Top area x2

### Text on the board
Top: Actor 6CH ver. 1.00_20.07.13